# EAGLE schematic blink1mk3-usbctest1 (EAGLE 9.0.1)
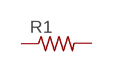
[diagram p0: schematic, sheet 1]

## Parts
R1  R-US_R0603  [R0603]
Unconnected: R1.1 R1.2

## Library data of the parts
R1 = resistor:R-US_: RESISTOR, American symbol